# EAGLE design H3AR0 (EAGLE 9.6.1)
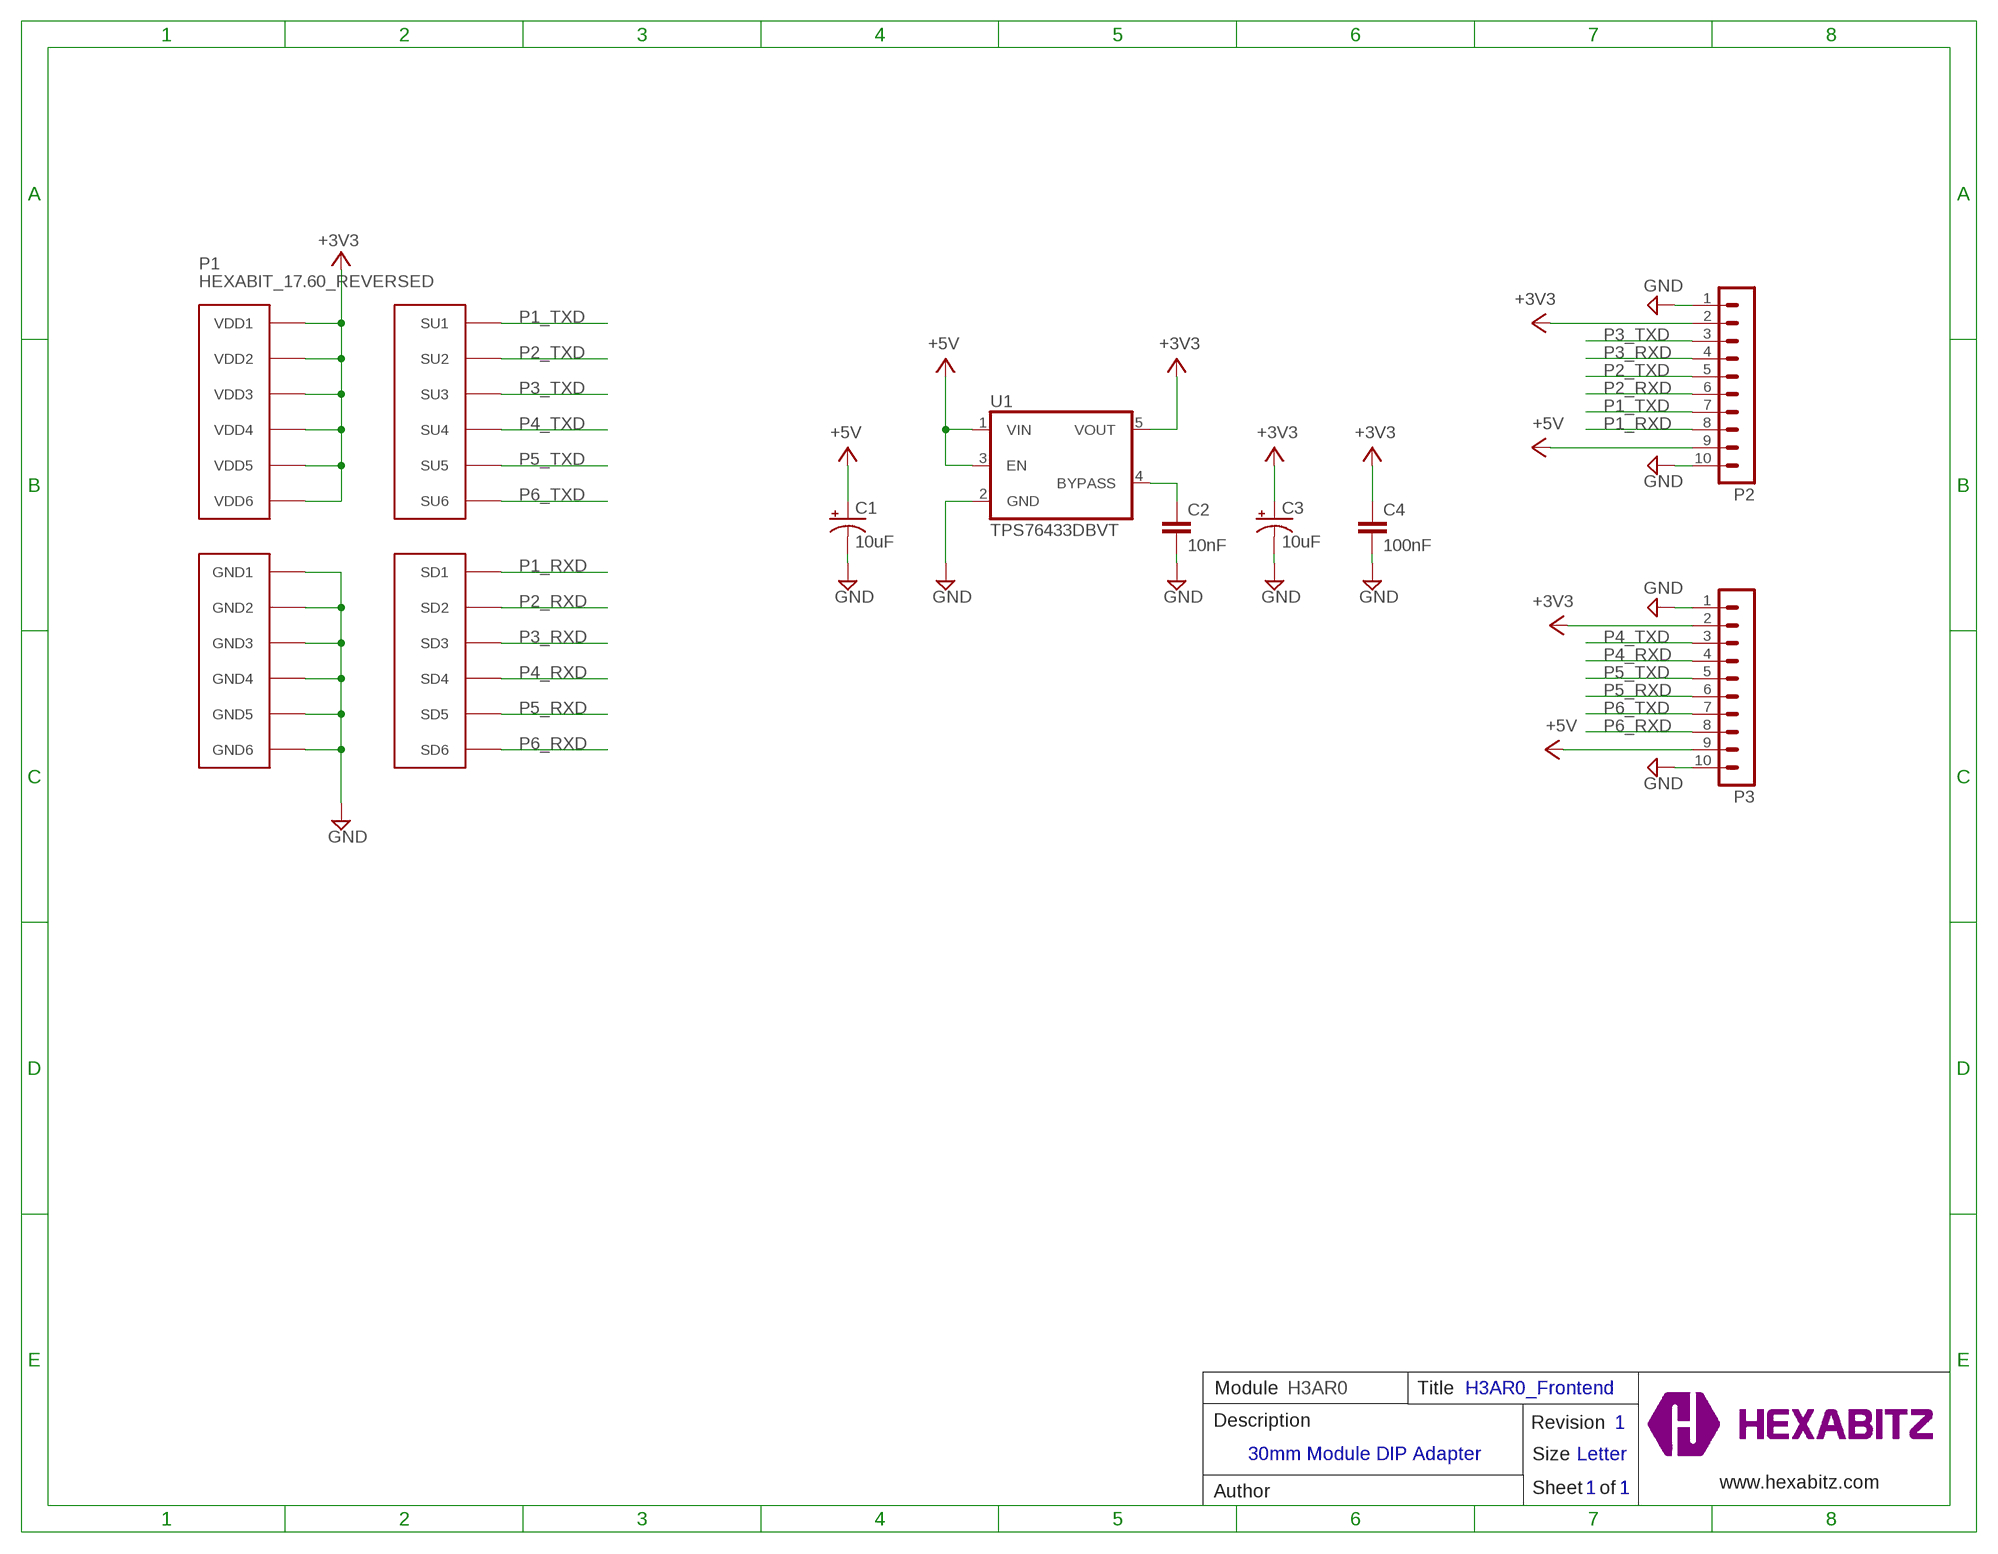
[diagram p0: schematic, sheet 1]

## Parts
C1  10uF  C-1210-POL  [C-1210-POL]
C2  10nF  C-0603  [C-0603]
C3  10uF  C-1210-POL  [C-1210-POL]
C4  100nF  C-0603  [C-0603]
P1  HEXABIT_17.60_REVERSED  [HEXABIT_17.60_REVERSED]
P2  MA10-1  [MA10-1]
P3  MA10-1  [MA10-1]
TRIMBLE-LOGO1  HEXA-LOGO  [HEXA-LOGO]
U1  TPS76433DBVT  [SOT25]

## Nets
+3V3: C3.1(+) C4.1 P1.PAD_PU7(VDD1) P1.PAD_PU8(VDD2) P1.PAD_PU9(VDD3) P1.PAD_PU10(VDD4) P1.PAD_PU11(VDD5) P1.PAD_PU12(VDD6) P2.2 P3.2 U1.5(VOUT)
+5V: C1.1(+) P2.9 P3.9 U1.1(VIN) U1.3(EN)
GND: C1.2(-) C2.2 C3.2(-) C4.2 P1.PAD_PD7(GND1) P1.PAD_PD8(GND2) P1.PAD_PD9(GND3) P1.PAD_PD10(GND4) P1.PAD_PD11(GND5) P1.PAD_PD12(GND6) P2.1 P2.10 P3.1 P3.10 U1.2(GND)
N$1: C2.1 U1.4(BYPASS)
P1_RXD: P1.PAD_PD1(SD1) P2.8
P1_TXD: P1.PAD_PU1(SU1) P2.7
P2_RXD: P1.PAD_PD2(SD2) P2.6
P2_TXD: P1.PAD_PU2(SU2) P2.5
P3_RXD: P1.PAD_PD3(SD3) P2.4
P3_TXD: P1.PAD_PU3(SU3) P2.3
P4_RXD: P1.PAD_PD4(SD4) P3.4
P4_TXD: P1.PAD_PU4(SU4) P3.3
P5_RXD: P1.PAD_PD5(SD5) P3.6
P5_TXD: P1.PAD_PU5(SU5) P3.5
P6_RXD: P1.PAD_PD6(SD6) P3.8
P6_TXD: P1.PAD_PU6(SU6) P3.7

## Notes on the sheet
- Module | H3AR0 | Title | H3AR0_Frontend
- Description | Revision | 1
- 30mm Module DIP Adapter
- Size | Letter
- www.hexabitz.com
- Author | Sheet   of | 1 | 1
- C:/Users/Admin/Desktop/logodraft.bmp

## Library data of the parts
C1 C3 = Hexabitz:C-1210-POL: Cap Tant Solid SMD 1210 Pol; CAPACITANCE: 10uF; MFN: AVX; MPN: TPSB106K016R0500; OCTOPART_URL: https://octopart.com/tpsb106k016r0500-avx-1436890?r=sp#
C2 = Hexabitz:C-0603: CAP CER 10% X7R 0603; CAPACITANCE: 10nF; MFN: KEMET; MPN: C0603C103K5RACTU; OCTOPART_URL: https://octopart.com/c0603c103k5ractu-kemet-133094?r=sp&s=R_iPBxLnSmGqhkU2rIMFpg; TOLERANCE: 10%; VOLTAGE_RATING: 50V
C4 = Hexabitz:C-0603: CAP CER 10% X7R 0603; CAPACITANCE: 100nF; MFN: KEMET; MPN: C0603C104K8RACTU; OCTOPART_URL: https://octopart.com/c0603c104k8ractu-kemet-145075?r=sp&s=9bS9ASSwSEqMCE9KBEQZ0g; TOLERANCE: 10%; VOLTAGE_RATING: 10V
P1 = hexabitz_connectors:HEXABIT_?_REVERSED: Hexabitz Hexagon Module Connector Hexagon side length = 18.00mm. Reversed inside-out.
P2 P3 = Hexabitz:MA10-1: PIN HEADER; MFN: Würth Elektronik; MPN: 61301011121; OCTOPART_URL: https://octopart.com/61301011121-w%C3%BCrth+elektronik-18818159?r=sp; OC_FARNELL: unknown; OC_NEWARK: unknown
TRIMBLE-LOGO1 = HEXABITZ_USER_INTERFACE_PARTS:HEXA-LOGO: Trimble-Logo
U1 = Hexabitz:TPS764: 150mA Low Noise LDO Voltage Regulator with Enable; MFN: Texas Instruments; MPN: TPS76433DBVT; OCTOPART_URL: https://octopart.com/tps76433dbvt-texas+instruments-69873?r=sp&s=0aHKKhMLSUCTmmqJkhwwIQ

## Board
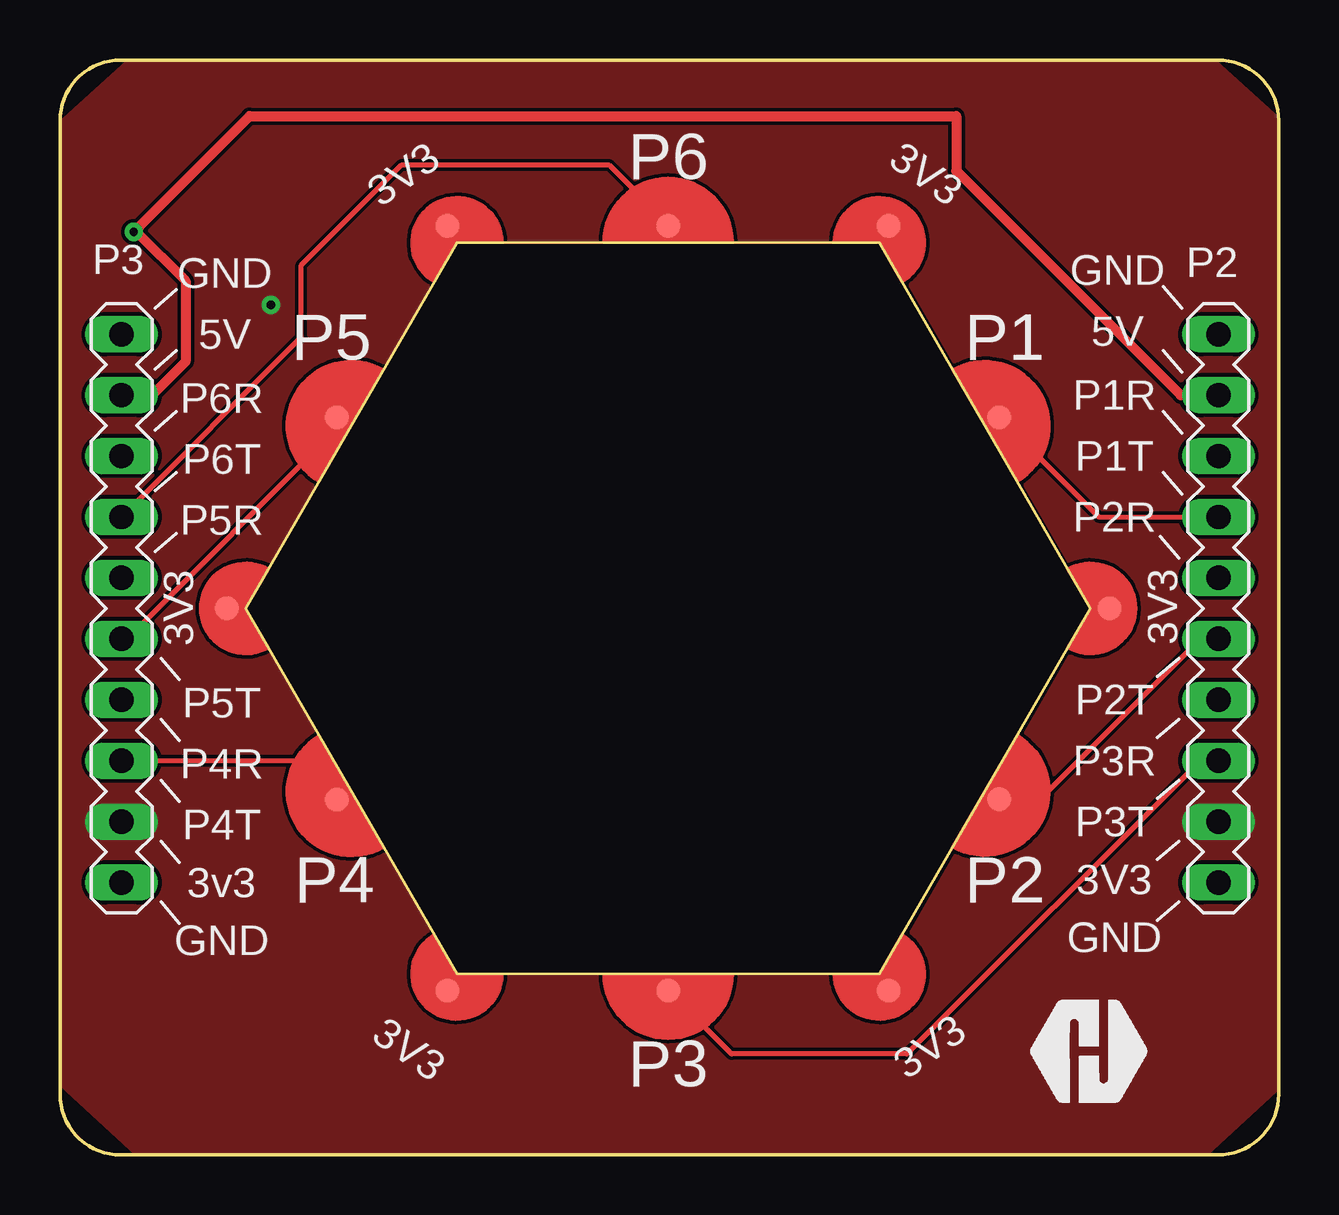
[diagram p1: board, top side]
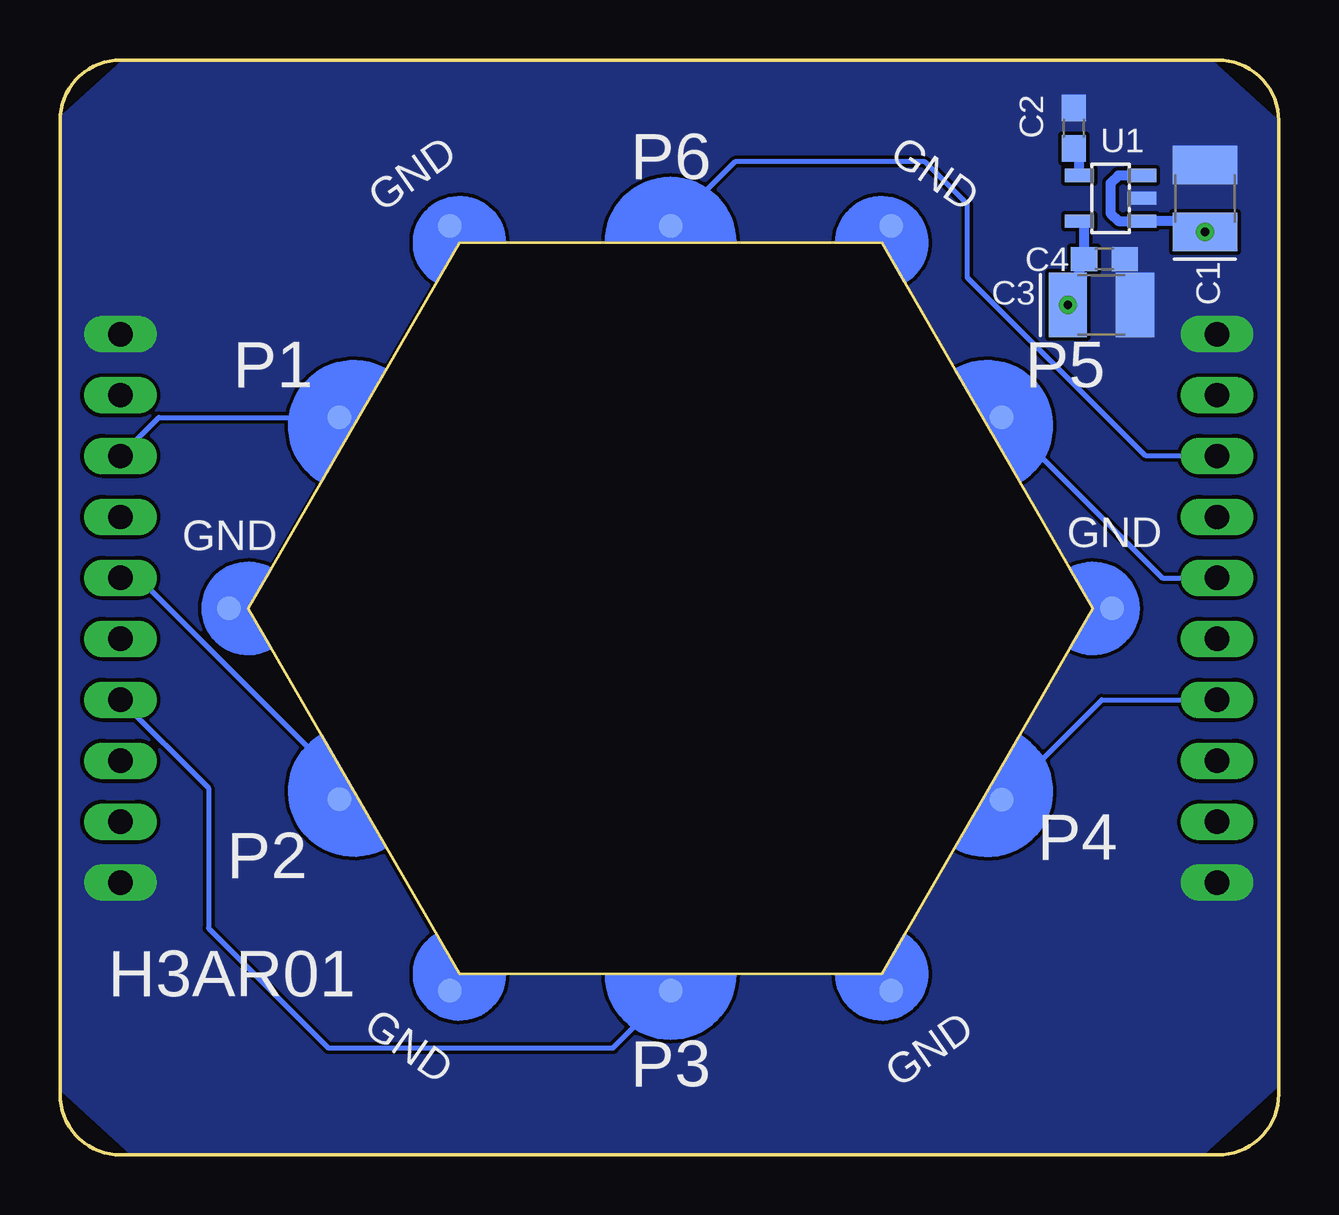
[diagram p2: board, bottom side, seen from below]

Size 50.8 x 45.64 mm. Coordinates in mm from the lower left corner, seen from the top.
Outline: 0,2.54 0,43.1 arc-90 2.54,45.64 48.26,45.64 arc-90 50.8,43.1 50.8,2.54 arc-90 48.26,0 2.54,0 arc-90 0,2.54
Copper layers (1*16): Top 0.035mm / dielectric 1.5mm / Bottom 0.035mm
Design rules "2_layer *": minimum track width 7mil, minimum drill 10mil, track to track 6mil, track to pad 6mil, pad to pad 6mil, via to via 6mil, smd to smd 0mil, copper to edge 0.000253125mm, drill to drill 8mil, minimum pad ring 10mil, minimum via ring 8mil, stop-mask expansion 2mil, vias tented up to drill 15mil, thermal gap 10mil

### Footprints (pad centres in the part's own frame; a part is rotated, then mirrored left to right if it is on the bottom)
C-1210-POL = smd 1.6 x 2.7: 1 -1.4,0; 2 1.4,0
C-0603 = smd 1.1 x 1: 1 -0.85,0; 2 0.85,0
HEXABIT_17.60_REVERSED = smd 1 x 1 bottom: PAD_PD1 13.8,7.957; PAD_PD2 13.8,-7.957; PAD_PD3 0,-15.934; PAD_PD4 -13.8,-7.977; PAD_PD5 -13.8,7.957; PAD_PD6 0,15.934; PAD_PD7 9.2,15.934; PAD_PD8 18.4,0; PAD_PD9 9.2,-15.934; PAD_PD10 -9.2,-15.934; PAD_PD11 -18.4,0; PAD_PD12 -9.2,15.934 | smd 1 x 1: PAD_PU1 13.8,7.957; PAD_PU2 13.8,-7.957; PAD_PU3 0,-15.934; PAD_PU4 -13.8,-7.977; PAD_PU5 -13.8,7.957; PAD_PU6 0,15.934; PAD_PU7 9.2,15.934; PAD_PU8 18.4,0; PAD_PU9 9.2,-15.934; PAD_PU10 -9.2,-15.934; PAD_PU11 -18.4,0; PAD_PU12 -9.2,15.934
MA10-1 = drill 1.016 long: 1 -11.43,0; 2 -8.89,0; 3 -6.35,0; 4 -3.81,0; 5 -1.27,0; 6 1.27,0; 7 3.81,0; 8 6.35,0; 9 8.89,0; 10 11.43,0
SOT25 = smd 0.55 x 1.2: 1 -0.95,-1.3; 2 0,-1.3; 3 0.95,-1.3; 4 0.95,1.3; 5 -0.95,1.3

### Placement (x,y rotation side)
C1  3.07,39.88 90 bottom
C2  8.53,42.8 90 bottom
C3  7.39,35.43 0 bottom
C4  7.26,37.34 0 bottom
P1  25.35,22.78 0 top
P2  48.29,22.78 90 top
P3  2.57,22.78 90 top
TRIMBLE-LOGO1  42.95,2.16 0 top
U1  7.01,39.88 90 bottom

### Tracks (layer width: path | path; a pad name or v marks a point on that pad's centre or on a via)
+3V3  (via drill 0.35 pad 0.75)
  Bottom 0.406: C3.1 C4.1 8.11,38.73 U1.5
  other vias: 8.79,35.43
  pour Top (no thermals): 7.77,22.73 16.54,37.97 25.43,38.1 25.3,45.59 2.82,45.59 0.15,43.18 0.03,2.92 3.2,0 27.08,0 26.95,7.49 16.54,7.49
  pour Top (no thermals): 43.21,22.73 34.44,37.97 23.78,38.13 23.9,45.59 48.16,45.59 50.83,43.18 50.95,2.92 47.78,0 25.17,0 25.3,7.49 34.44,7.49
+5V  (via drill 0.35)
  Top 0.406: P3.9 3.84,31.67 5.23,33.07 5.23,36.44 3.2,38.48 C1.1 7.91,43.31 37.36,43.31 37.36,41.02 46.71,31.67 P2.9
  Bottom 0.406: C1.1 3.53,38.93 U1.1 6.7,38.93 7.01,39.24 7.01,40.51 6.7,40.83 U1.3
  other vias: 3.07,38.48
GND
  pour Bottom (no thermals): 7.77,22.73 16.54,37.97 25.43,38.1 25.3,45.59 2.82,45.59 0.15,43.18 0.03,2.92 3.2,0 27.08,0 26.95,7.49 16.54,7.49
  pour Bottom (no thermals): 43.21,22.73 34.44,37.97 23.78,38.13 23.9,45.59 48.16,45.59 50.83,43.18 50.95,2.92 47.78,0 25.17,0 25.3,7.49 34.44,7.49
N$1
  Bottom 0.406: U1.4 8.31,41.73 C2.1
P1_RXD
  Bottom 0.203: P2.8 46.68,30.74 P1.PAD_PD1
P1_TXD
  Top 0.203: P1.PAD_PU1 43.3,26.59 P2.7
P2_RXD
  Bottom 0.203: P2.6 47.52,24.05 39.15,15.68 P1.PAD_PD2
P2_TXD
  Top 0.203: P2.5 47.52,21.51 40.84,14.83 P1.PAD_PU2
P3_RXD
  Bottom 0.203: P2.4 44.6,15.29 44.6,9.45 39.61,4.46 27.74,4.46 P1.PAD_PD3
P3_TXD
  Top 0.203: P2.3 47.52,16.43 35.3,4.21 27.99,4.21 P1.PAD_PU3
P4_RXD
  Bottom 0.203: P1.PAD_PD4 7.38,18.97 P3.4
P4_TXD
  Top 0.203: P1.PAD_PU4 9.92,16.43 P3.3
P5_RXD
  Bottom 0.203: P1.PAD_PD5 4.86,24.05 P3.6
P5_TXD
  Top 0.203: P1.PAD_PU5 11.55,30.27 2.79,21.51 P3.5
P6_RXD
  Bottom 0.203: P3.8 5.54,29.13 12.98,36.58 12.98,39.62 14.76,41.4 22.66,41.4 P1.PAD_PD6
P6_TXD
  Top 0.203: P1.PAD_PU6 25.35,38.81 22.89,41.27 14.25,41.27 10.06,37.08 10.06,34.09 P3.7

### Text on the board
tPlace: P6 | 3V3 | 3V3 | GND | GND | 5V | P5 | P1 | 5V | P6R | P1R | P6T | P1T | P2R | P5R | 3V3 | 3V3 | P5T | P2T | P4R | P3R | P4T | P3T | 3v3 | P4 | P2 | 3V3 | GND | GND | 3V3 | 3V3 | P3
bPlace: P6 | GND | GND | P5 | P1 | GND | GND | P4 | P2 | H3AR01 | GND | GND | P3